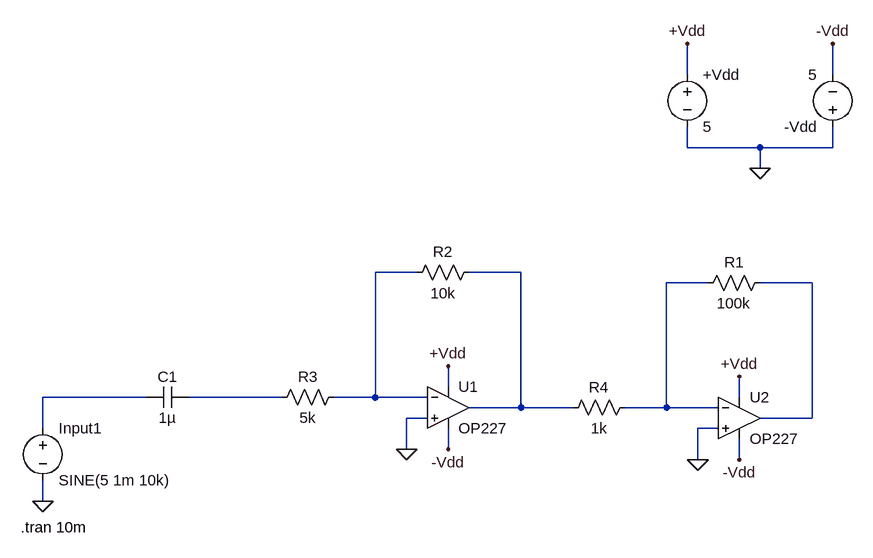
[diagram p0: schematic FinalProject_v1.asc]
FinalProject_v1.asc, the LTspice schematic file:
Version 4
SHEET 1 940 680
WIRE 576 -208 576 -256
WIRE 800 -208 800 -256
WIRE 576 -96 576 -128
WIRE 688 -96 576 -96
WIRE 800 -96 800 -128
WIRE 800 -96 688 -96
WIRE 688 -64 688 -96
WIRE 160 96 96 96
WIRE 320 96 240 96
WIRE 608 112 544 112
WIRE 768 112 688 112
WIRE 208 272 208 240
WIRE -256 288 -416 288
WIRE -48 288 -192 288
WIRE 96 288 96 96
WIRE 96 288 32 288
WIRE 176 288 96 288
WIRE 656 288 656 256
WIRE 320 304 320 96
WIRE 320 304 240 304
WIRE 400 304 320 304
WIRE 544 304 544 112
WIRE 544 304 480 304
WIRE 624 304 544 304
WIRE 176 320 144 320
WIRE 768 320 768 112
WIRE 768 320 688 320
WIRE -416 336 -416 288
WIRE 624 336 592 336
WIRE 144 368 144 320
WIRE 208 368 208 336
WIRE 592 384 592 336
WIRE 656 384 656 352
WIRE -416 448 -416 416
FLAG 144 368 0
FLAG 688 -64 0
FLAG 576 -256 +Vdd
FLAG 800 -256 -Vdd
FLAG 208 240 +Vdd
FLAG 208 368 -Vdd
FLAG 592 384 0
FLAG 656 256 +Vdd
FLAG 656 384 -Vdd
FLAG -416 448 0
SYMBOL OpAmps\\OP227 208 240 R0
SYMATTR InstName U1
SYMBOL voltage 576 -224 R0
WINDOW 123 0 0 Left 0
WINDOW 39 0 0 Left 0
SYMATTR InstName +Vdd
SYMATTR Value 5
SYMBOL voltage 800 -112 R180
WINDOW 123 0 0 Left 0
WINDOW 39 0 0 Left 0
SYMATTR InstName -Vdd
SYMATTR Value 5
SYMBOL res 256 80 R90
WINDOW 0 0 56 VBottom 2
WINDOW 3 32 56 VTop 2
SYMATTR InstName R2
SYMATTR Value 10k
SYMBOL res 48 272 R90
WINDOW 0 0 56 VBottom 2
WINDOW 3 32 56 VTop 2
SYMATTR InstName R3
SYMATTR Value 5k
SYMBOL OpAmps\\OP227 656 256 R0
SYMATTR InstName U2
SYMBOL res 704 96 R90
WINDOW 0 0 56 VBottom 2
WINDOW 3 32 56 VTop 2
SYMATTR InstName R1
SYMATTR Value 100k
SYMBOL res 496 288 R90
WINDOW 0 0 56 VBottom 2
WINDOW 3 32 56 VTop 2
SYMATTR InstName R4
SYMATTR Value 1k
SYMBOL cap -192 272 R90
WINDOW 0 0 32 VBottom 2
WINDOW 3 32 32 VTop 2
SYMATTR InstName C1
SYMATTR Value 1µ
SYMBOL voltage -416 320 R0
WINDOW 123 24 124 Left 2
WINDOW 39 0 0 Left 0
SYMATTR InstName Input1
SYMATTR Value SINE(5 1m 10k)
TEXT -450 488 Left 2 !.tran 10m

The netlist it stands for:
* FinalProject_v1.asc
XU1 0 N001 +Vdd -Vdd N002 OP227  ; pins In+ In- V+ V- OUT
V§+Vdd +Vdd 0 5
V§-Vdd 0 -Vdd 5
R2 N002 N001 10k
R3 N001 N006 5k
XU2 0 N003 +Vdd -Vdd N004 OP227  ; pins In+ In- V+ V- OUT
R1 N004 N003 100k
R4 N003 N002 1k
C1 N006 N005 1µ
V§Input1 N005 0 SINE(5 1m 10k)
.tran 10m
.backanno
.end